# Altium schematic sheet STM32F407开发板3.SchDoc
size 317 x 281 mm
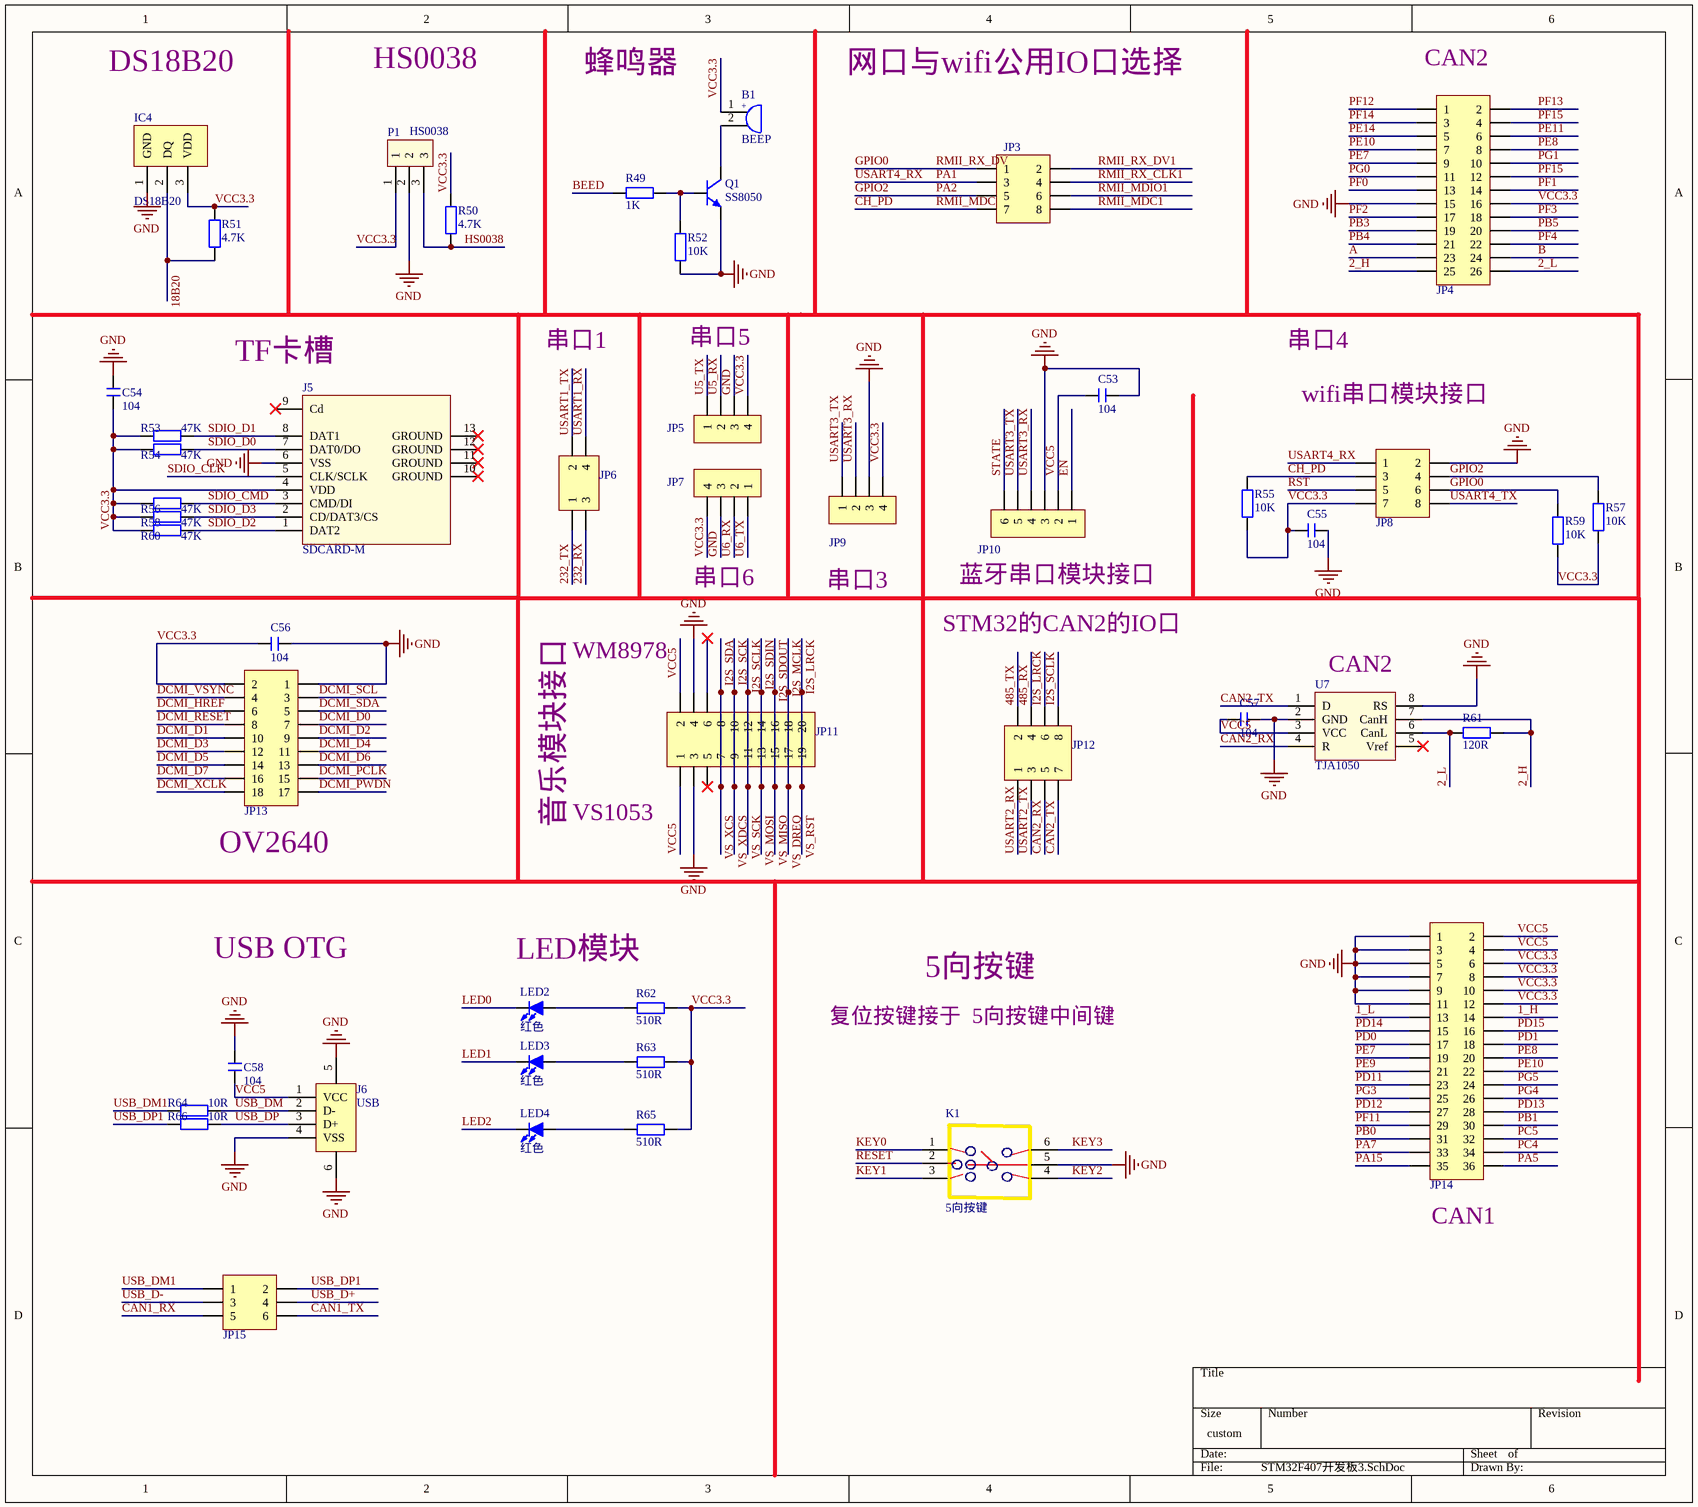
[diagram p0: STM32F407开发板3.SchDoc]

## Parts
B1  BEEP  [BEEP 5x9x5.5]
C53  104  [C 0603]
C54  104  [C 0603]
C55  104  [C 0603]
C56  104  [C 0603]
C57  104  [C 0603]
C58  104  [C 0603]
IC4  DS18B20  [TO92A]
J5  SDCARD-M  [Micro TF/SD]
J6  USB  [USB-A/S_A]
JP3  Header 4X2  [HDR-4X2]  (value not drawn)
JP4  Header 2X11  [HDR-13X2]  (value not drawn)
JP5  HDR-1X4  [HDR-1X4]  (value not drawn)
JP6  Header2X2  [HDR-2X2]  (value not drawn)
JP7  HDR-1X4  [HDR-1X4]  (value not drawn)
JP8  Header 4X2  [HDR-4X2]  (value not drawn)
JP9  HDR-1X4  [HDR-1X4]  (value not drawn)
JP10  HDR-1X6  [HDR-1X6]  (value not drawn)
JP11  Header 2X10  [HDR-10X2]  (value not drawn)
JP12  Header 4X2  [HDR-4X2]  (value not drawn)
JP13  Header 9X2  [HDR-9X2]  (value not drawn)
JP14  Header 2X11  [HDR-18X2]  (value not drawn)
JP15  Header3X2  [HDR-3X2]  (value not drawn)
K1  5向按键  [五向按键]
LED2  红色  [LED 0603R]
LED3  红色  [LED 0603R]
LED4  红色  [LED 0603R]
P1  HS0038  [VS1838B-A]
Q1  SS8050  [SOT23-3L]
R49  1K  [R 0603]
R50  4.7K  [R 0603]
R51  4.7K  [R 0603]
R52  10K  [R 0603]
R53  47K  [R 0603]
R54  47K  [R 0603]
R55  10K  [R 0603]
R56  47K  [R 0603]
R57  10K  [R 0603]
R58  47K  [R 0603]
R59  10K  [R 0603]
R60  47K  [R 0603]
R61  120R  [R 0603]
R62  510R  [R 0603]
R63  510R  [R 0603]
R64  10R  [R 0603]
R65  510R  [R 0603]
R66  10R  [R 0603]
U7  TJA1050  [TJA1050]

## Nets
GND: C53.1 C54.2 C55.2 C56.1 C57.2 C58.2 IC4.1(GND) J5.6(VSS) J6.4(VSS) J6.5 J6.6 JP4.15 JP5.3 JP7.3 JP8.2 JP9.3 JP10.3 JP11.3 JP11.4 JP13.1 JP14.1 JP14.3 JP14.5 JP14.7 JP14.9 JP14.11 K1.5 P1.2 Q1.2(E) R52.1 U7.2(GND) U7.8(RS)
1_H: JP14.14
1_L: JP14.13
2_H: JP4.25 R61.1 U7.7(CanH)
2_L: JP4.26 R61.2 U7.6(CanL)
18B20: IC4.2(DQ) R51.1
232_RX: JP6.3
232_TX: JP6.1
485_RX: JP12.4
485_TX: JP12.2
A: JP4.23
B: JP4.24
BEED: R49.2
CAN1_RX: JP15.5
CAN1_TX: JP15.6
CAN2_RX: JP12.5 U7.4(R)
CAN2_TX: JP12.7 U7.1(D)
CH_PD: JP3.7 JP8.3 R55.2  [also labelled RMII_MDC]
DCMI_D0: JP13.7
DCMI_D1: JP13.10
DCMI_D2: JP13.9
DCMI_D3: JP13.12
DCMI_D4: JP13.11
DCMI_D5: JP13.14
DCMI_D6: JP13.13
DCMI_D7: JP13.16
DCMI_HREF: JP13.6
DCMI_PCLK: JP13.15
DCMI_PWDN: JP13.17
DCMI_RESET: JP13.8
DCMI_SCL: JP13.3
DCMI_SDA: JP13.5
DCMI_VSYNC: JP13.4
DCMI_XCLK: JP13.18
EN: JP10.1
GPIO0: JP3.1 JP8.6 R59.2  [also labelled RMII_RX_DV]
GPIO2: JP3.5 JP8.4 R57.2  [also labelled PA2]
HS0038: P1.3 R50.1
I2S_LRCK: JP11.19 JP11.20 JP12.6  [also labelled VS_RST]
I2S_MCLK: JP11.17 JP11.18  [also labelled VS_DREQ]
I2S_SCK: JP11.9 JP11.10  [also labelled VS_XDCS]
I2S_SCLK: JP11.11 JP11.12 JP12.8  [also labelled VS_SCK]
I2S_SDA: JP11.7 JP11.8  [also labelled VS_XCS]
I2S_SDIN: JP11.13 JP11.14  [also labelled VS_MOSI]
I2S_SDOUT: JP11.15 JP11.16  [also labelled VS_MISO]
KEY0: K1.1
KEY1: K1.3
KEY2: K1.4
KEY3: K1.6
LED0: LED2.2(K)
LED1: LED3.2(K)
LED2: LED4.2(K)
PA1: JP3.3 JP8.1  [also labelled USART4_RX]
PA5: JP14.36
PA7: JP14.33
PA15: JP14.35
PB0: JP14.31
PB1: JP14.30
PB3: JP4.19
PB4: JP4.21
PB5: JP4.20
PC4: JP14.34
PC5: JP14.32
PD0: JP14.17
PD1: JP14.18
PD11: JP14.23
PD12: JP14.27
PD13: JP14.28
PD14: JP14.15
PD15: JP14.16
PE7: JP4.9 JP14.19
PE8: JP4.8 JP14.20
PE9: JP14.21
PE10: JP4.7 JP14.22
PE11: JP4.6
PE14: JP4.5
PF0: JP4.13
PF1: JP4.14
PF2: JP4.17
PF3: JP4.18
PF4: JP4.22
PF11: JP14.29
PF12: JP4.1
PF13: JP4.2
PF14: JP4.3
PF15: JP4.4 JP4.12
PG0: JP4.11
PG1: JP4.10
PG3: JP14.25
PG4: JP14.26
PG5: JP14.24
RESET: K1.2
RMII_MDC1: JP3.8
RMII_MDIO1: JP3.6
RMII_RX_CLK1: JP3.4
RMII_RX_DV1: JP3.2
RST: JP8.5
SDIO_CLK: J5.5(CLK/SCLK)
SDIO_CMD: J5.3(CMD/DI) R56.1
SDIO_D0: J5.7(DAT0/DO) R54.1
SDIO_D1: J5.8(DAT1) R53.1
SDIO_D2: J5.1(DAT2) R60.1
SDIO_D3: J5.2(CD/DAT3/CS) R58.1
STATE: JP10.6
U5_RX: JP5.2
U5_TX: JP5.1
U6_RX: JP7.2
U6_TX: JP7.1
USART1_RX: JP6.4
USART1_TX: JP6.2
USART2_RX: JP12.1
USART2_TX: JP12.3
USART3_RX: JP9.2 JP10.4
USART3_TX: JP9.1 JP10.5
USART4_TX: JP8.8
USB_D+: JP15.4
USB_D-: JP15.3
USB_DM: J6.2(D-) R64.1
USB_DM1: JP15.1 R64.2
USB_DP: J6.3(D+) R66.1
USB_DP1: JP15.2 R66.2
VCC3.3: B1.1 C54.1 C55.1 C56.2 IC4.3(VDD) J5.4(VDD) JP4.16 JP5.4 JP7.4 JP8.7 JP9.4 JP13.2 JP14.6 JP14.8 JP14.10 JP14.12 P1.1 R50.2 R51.2 R53.2 R54.2 R55.1 R56.2 R57.1 R58.2 R59.1 R60.2 R62.1 R63.1 R65.1
VCC5: C53.2 C57.1 C58.1 J6.1(VCC) JP10.2 JP11.1 JP11.2 JP14.2 JP14.4 U7.3(VCC)
NetB1_2: B1.2 Q1.3(C)
NetLED2_1: LED2.1(A) R62.2
NetLED3_1: LED3.1(A) R63.2
NetLED4_1: LED4.1(A) R65.2
NetQ1_1: Q1.1(B) R49.1 R52.2

Not connected (* = marked no-connect by the designer): J5 9(Cd)* 10(GROUND)* 11(GROUND)* 12(GROUND)* 13(GROUND)*; JP11 5* 6*; U7 5(Vref)*

## Notes on the sheet
- DS18B20
- HS0038
- 蜂鸣器
- 网口与wifi公用IO口选择
- (near JP4) CAN2
- (near J5) TF卡槽
- 串口1
- 串口5
- 串口4
- wifi串口模块接口
- (near JP10) 蓝牙串口模块接口
- 串口6
- 串口3
- STM32的CAN2的IO口
- WM8978
- (near U7) CAN2
- (near JP13) OV2640
- 音乐模块接口
- (near JP11) VS1053
- USB OTG
- LED模块
- 5向按键
- 复位按键接于  5向按键中间键
- (near JP14) CAN1
- (in symbol BEEP) +

## Library data of the parts
B1 = BEEP: 蜂鸣器; 版权归属: 源创客; BOM名称: 蜂鸣器; 学习资源: www.ooocke.com
C53-C58 = C: 无极性贴片电容; 版权归属: 源创客; BOM名称: 无极性贴片电容; 学习资源: www.ooocke.com
IC4 = DS18B20: 数字温度计; 版权归属: 源创客; BOM名称: 数字温度计; 学习资源: www.ooocke.com
J5 = SDCARD-M: TF卡槽
J6 = USB OTG
JP3 JP8 JP12 = Header 4X2: 4*2P接插件; 版权归属: 源创客; BOM名称: 4*2P接插件; 学习资源: www.ooocke.com
JP4 = Header 13X2: 13*2P接插件; 版权归属: 源创客; BOM名称: 13*2P接插件; 学习资源: www.ooocke.com
JP5 JP7 JP9 = Header 4: 4P接插件; 版权归属: 源创客; BOM名称: 4P接插件; 学习资源: www.ooocke.com
JP6 = Header 2X2: 2*2P接插件; 版权归属: 源创客; BOM名称: 2*2P接插件; 学习资源: www.ooocke.com
JP10 = Header 6: 6P接插件; 版权归属: 源创客; BOM名称: 6P接插件; 学习资源: www.ooocke.com
JP11 = Header 10X2: 10*2P接插件; 版权归属: 源创客; BOM名称: 10*2P接插件; 学习资源: www.ooocke.com
JP13 = Header 9X2: 9*2P接插件; 版权归属: 源创客; BOM名称: 9*2P接插件; 学习资源: www.ooocke.com
JP14 = Header 18X2: 18*2P接插件; 版权归属: 源创客; BOM名称: 18*2P接插件; 学习资源: www.ooocke.com
JP15 = Header 3X2: 3*2P接插件; 版权归属: 源创客; BOM名称: 3*2P接插件; 学习资源: www.ooocke.com
LED2-LED4 = LED-5MM: 5mm插件LED; 版权归属: 源创客; BOM名称: 5mm插件LED; 学习资源: www.ooocke.com
Q1 = 8050-SMD: 高频放大-NPN型; 版权归属: 源创客; 属性: 40V 1.5A 1W 100MHZ; BOM名称: 高频放大-NPN型; 学习资源: www.ooocke.com
R49-R66 = R: 贴片电阻; 版权归属: 源创客; BOM名称: 贴片电阻; 学习资源: www.ooocke.com